# Altium project PCB_Project_1.PrjPcb
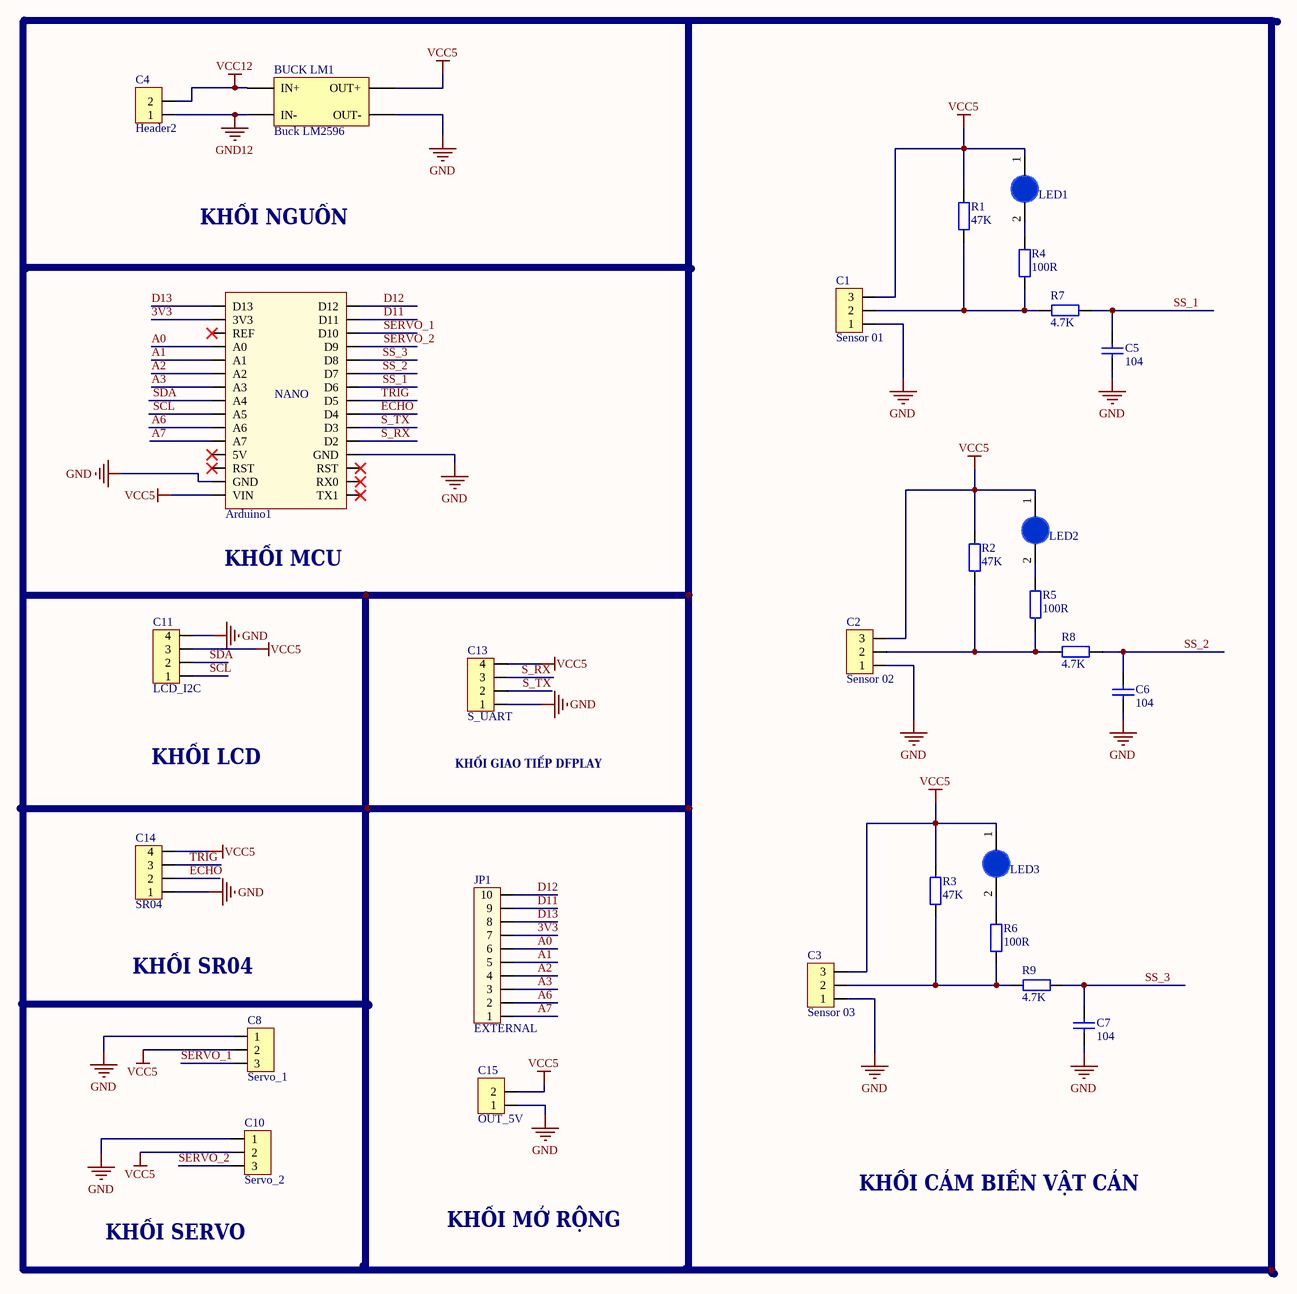
[diagram p0: Sheet1.SchDoc]
1 sheet, 28 parts. Net scope: global (net labels, ports and power ports of the same name join across sheets).
Board file: PCB1.PcbDoc

## Sheet Sheet1.SchDoc
size A2; SheetNumber: 1; SheetTotal: 1

### Parts
Arduino1  Arduino Nano  [Arduino Nano]  (value not drawn)
BUCK_LM1  Buck LM2596  [BUCK LM2596]
C1  Sensor 01  [Header3]
C2  Sensor 02  [Header3]
C3  Sensor 03  [Header3]
C4  Header2  [Header2]
C5  104  [tu gom]
C6  104  [tu gom]
C7  104  [tu gom]
C8  Servo_1  [Header3]
C10  Servo_2  [Header3]
C11  LCD_I2C  [Header4]
C13  S_UART  [Header4]
C14  SR04  [Header4]
C15  OUT_5V  [Header2]
JP1  EXTERNAL  [Header10]
LED1  LED 3mm  [LED-3MM-BLUE]  (value not drawn)
LED2  LED 3mm  [LED-3MM-BLUE]  (value not drawn)
LED3  LED 3mm  [LED-3MM-BLUE]  (value not drawn)
R1  47K  [R1/4W]
R2  47K  [R1/4W]
R3  47K  [R1/4W]
R4  100R  [R1/4W]
R5  100R  [R1/4W]
R6  100R  [R1/4W]
R7  4.7K  [R1/4W]
R8  4.7K  [R1/4W]
R9  4.7K  [R1/4W]

### Nets
GND: Arduino1.GND BUCK_LM1.3(OUT-) C1.1 C2.1 C3.1 C5.2 C6.2 C7.2 C8.1 C10.1 C11.4 C13.1 C14.1 C15.1
GND12: BUCK_LM1.2(IN-) C4.1
VCC5: Arduino1.VIN BUCK_LM1.4(OUT+) C1.3 C2.3 C3.3 C8.2 C10.2 C11.3 C13.4 C14.4 C15.2 LED1.1(A) LED2.1(A) LED3.1(A) R1.2 R2.2 R3.2
VCC12: BUCK_LM1.1(IN+) C4.2
3V3: Arduino1.3V3 JP1.7
A0: Arduino1.A0 JP1.6
A1: Arduino1.A1 JP1.5
A2: Arduino1.A2 JP1.4
A3: Arduino1.A3 JP1.3
A6: Arduino1.A6 JP1.2
A7: Arduino1.A7 JP1.1
D11: Arduino1.D11 JP1.9
D12: Arduino1.D12 JP1.10
D13: Arduino1.D13 JP1.8
ECHO: Arduino1.D4 C14.2
S_RX: Arduino1.D2 C13.3
S_TX: Arduino1.D3 C13.2
SCL: Arduino1.A5 C11.1
SDA: Arduino1.A4 C11.2
SERVO_1: Arduino1.D10 C8.3
SERVO_2: Arduino1.D9 C10.3
SS_1: Arduino1.D6 C5.1 R7.1
SS_2: Arduino1.D7 C6.1 R8.1
SS_3: Arduino1.D8 C7.1 R9.1
TRIG: Arduino1.D5 C14.3
NetC1_2: C1.2 R1.1 R4.1 R7.2
NetC2_2: C2.2 R2.1 R5.1 R8.2
NetC3_2: C3.2 R3.1 R6.1 R9.2
NetLED1_2: LED1.2(K) R4.2
NetLED2_2: LED2.2(K) R5.2
NetLED3_2: LED3.2(K) R6.2

Not connected (* = marked no-connect by the designer): Arduino1 5V* REF* RST* RX0* TX1*

### Notes on the sheet
- KHỐI NGUỒN
- KHỐI MCU
- KHỐI LCD
- KHỐI GIAO TIẾP DFPLAY
- KHỐI SR04
- KHỐI SERVO
- KHỐI MỞ RỘNG
- KHỐI CẢM BIẾN VẬT CẢN
- (in symbol Arduino Nano) NANO

### Library data of the parts
Arduino1 = Arduino Nano: Value: Cau 1A
C1-C3 C8 C10 = Header3: Header IDC, 3 x 1 Pin Vertical 2.54mm Pitch (Non-Boxed, Male); Manufacturer: W¨¹rth Elektronik eiSos GmbH; partNo: 613002143121; ComponentLink1 Description: Manufacturer; ComponentLink2 Description: Datasheet; NoPins: 02; Created Date: 29 March 2013; ComponentLink1URL: http://www.we-online.com; ComponentLink2URL: http://katalog.we-online.de/em/datasheet/6130xx143121.pdf; Created by: Karrer Zheng
C4 C15 = Header2: Header IDC, 2 x 1 Pin Vertical 2.54mm Pitch (Non-Boxed, Male); Manufacturer: W¨¹rth Elektronik eiSos GmbH; partNo: 613002143121; ComponentLink1 Description: Manufacturer; ComponentLink2 Description: Datasheet; NoPins: 02; Created Date: 29 March 2013; ComponentLink1URL: http://www.we-online.com; ComponentLink2URL: http://katalog.we-online.de/em/datasheet/6130xx143121.pdf; Created by: Karrer Zheng
C5-C7 = Tu gom 104 50V: Cắm; So_Chan: 2; Ten_Linh_Kien: Tụ gốm 104 100nF 50V; Don_Vi: Con; Ma_Hang: MH004761; Chung_Loai: Cắm; Kieu_Chan: *
C11 C13 C14 = Header4: Header IDC, 4 x 1 Pin Vertical 2.54mm Pitch (Non-Boxed, Male); Manufacturer: W¨¹rth Elektronik eiSos GmbH; partNo: 613002143121; ComponentLink1 Description: Manufacturer; ComponentLink2 Description: Datasheet; NoPins: 02; Created Date: 29 March 2013; ComponentLink1URL: http://www.we-online.com; ComponentLink2URL: http://katalog.we-online.de/em/datasheet/6130xx143121.pdf; Created by: Karrer Zheng
JP1 = Header10: Connector 10; Value: Connector 10
LED1-LED3 = LED 3mm Xanh Duong: Cắm; Don_Vi: Con; Ma_Hang: MH009003; Ten_Linh_Kien: LED 3MM Xanh Dương SS (1000c); Ghi_Chu: *; Kieu_Chan: *; Chung_Loai: Cắm
R1-R9 = R1/4W: Resistor 1/4W; Value: R1/4W - 1K